# Altium schematic sheet Sheet1.SchDoc
size A4; SheetNumber: 1; SheetTotal: 1
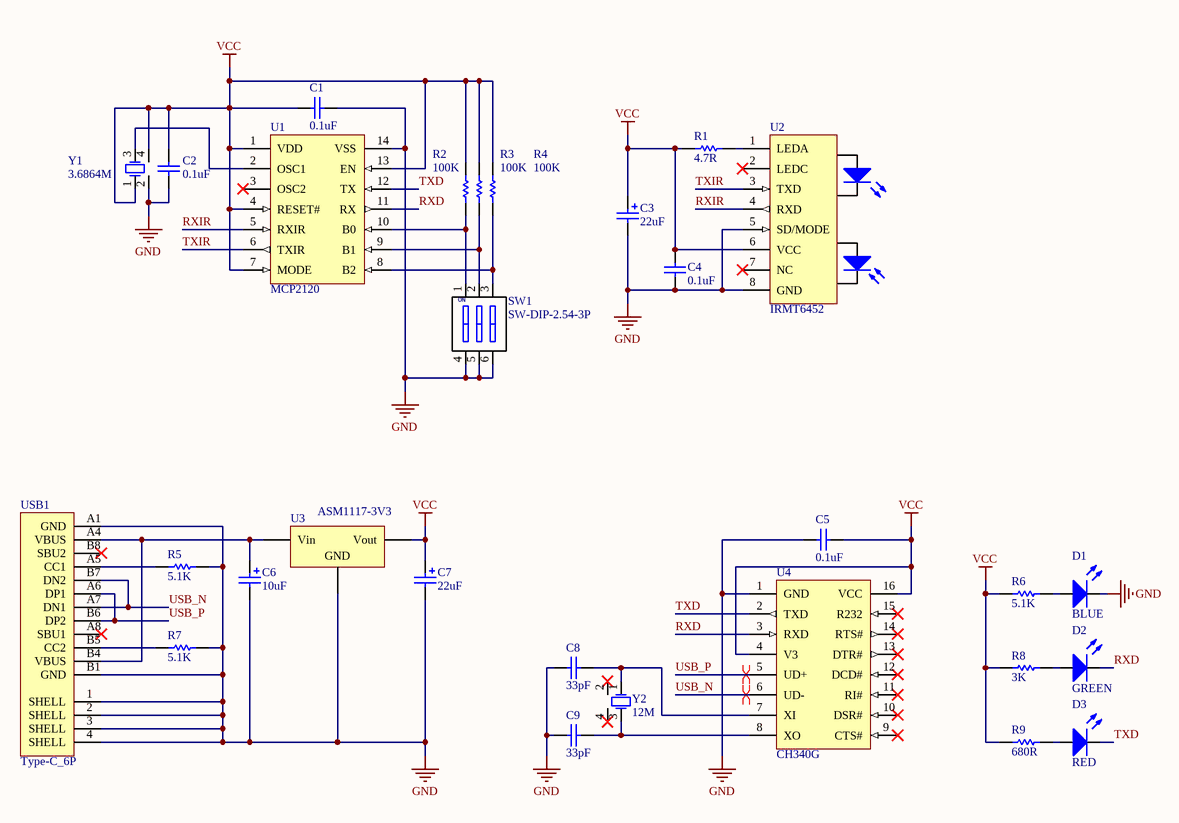
[diagram p0: Sheet1.SchDoc]

## Parts
C1  0.1uF  [0603-CAP]
C2  0.1uF  [0603-CAP]
C3  22uF  [3216-TCAP_M]
C4  0.1uF  [0603-CAP]
C5  0.1uF  [0603-CAP]
C6  10uF  [3216-TCAP_M]
C7  22uF  [3216-TCAP_M]
C8  33pF  [0603-CAP]
C9  33pF  [0603-CAP]
D1  BLUE  [0603-LED]
D2  GREEN  [0603-LED]
D3  RED  [0603-LED]
R1  4.7R  [0603-RES]
R2  100K  [0603-RES]
R3  100K  [0603-RES]
R4  100K  [0603-RES]
R5  5.1K  [0603-RES]
R6  5.1K  [0603-RES]
R7  5.1K  [0603-RES]
R8  3K  [0603-RES]
R9  680R  [0603-RES]
SW1  SW-DIP-2.54-3P  [SWITCH-DIP-2.54-3P]
U1  MCP2120  [SOP-14_M]
U2  IRMT6452  [IRMT6452_M]
U3  ASM1117-3V3  [SOT-89-3_M]
U4  CH340G  [SOP-16_M]
USB1  Type-C_6P  [TYPE-C_16P]
Y1  3.6864M  [CRYSTAL_3225SMD_M]
Y2  12M  [CRYSTAL_3225SMD_M]

## Nets
GND: C1.2 C2.1 C3.2 C4.1 C5.1 C6.2 C7.2 C8.1 C9.2 D1.1(K) R5.1 R7.1 SW1.4(B4) SW1.5(B5) SW1.6(B6) U1.14(VSS) U2.5(SD/MODE) U2.8(GND) U3.1(GND) U4.1(GND) USB1.1(SHELL) USB1.2(SHELL) USB1.3(SHELL) USB1.4(SHELL) USB1.A1(GND) USB1.B1(GND) Y1.2(GND)
VCC: C1.1 C2.2 C3.1 C4.2 C5.2 C7.1 R1.1 R2.2 R3.2 R4.2 R6.1 R8.1 R9.1 U1.1(VDD) U1.4(RESET#) U1.7(MODE) U1.13(EN) U2.6(VCC) U3.2(Vout) U4.4(V3) U4.16(VCC) Y1.1(OSC1) Y1.4(GND)
RXD: D2.1(K) U1.11(RX) U4.3(RXD)
RXIR: U1.5(RXIR) U2.4(RXD)
TXD: D3.1(K) U1.12(TX) U4.2(TXD)
TXIR: U1.6(TXIR) U2.3(TXD)
USB_N: U4.6(UD-) USB1.A7(DN1) USB1.B7(DN2)
USB_P: U4.5(UD+) USB1.A6(DP1) USB1.B6(DP2)
NetC6_1: C6.1 U3.3(Vin) USB1.A4(VBUS) USB1.B4(VBUS)
NetC8_2: C8.2 U4.7(XI) Y2.1(OSC1)
NetC9_1: C9.1 U4.8(XO) Y2.3(OSC2)
NetD1_2: D1.2(A) R6.2
NetD2_2: D2.2(A) R8.2
NetD3_2: D3.2(A) R9.2
NetR1_2: R1.2 U2.1(LEDA)
NetR2_1: R2.1 SW1.1(A1) U1.10(B0)
NetR3_1: R3.1 SW1.2(A2) U1.9(B1)
NetR4_1: R4.1 SW1.3(A3) U1.8(B2)
NetR5_2: R5.2 USB1.A5(CC1)
NetR7_2: R7.2 USB1.B5(CC2)
NetU1_2: U1.2(OSC1) Y1.3(OSC2)

Not connected (* = marked no-connect by the designer): U1 3(OSC2)*; U2 2(LEDC)* 7(NC)*; U4 9(CTS#)* 10(DSR#)* 11(RI#)* 12(DCD#)* 13(DTR#)* 14(RTS#)* 15(R232)*; USB1 A8(SBU1)* B8(SBU2)*; Y2 2(GND)* 4(GND)*

## Layout directives
differential pair: USB_N, USB_P

## Notes on the sheet
- (in symbol SW-DIP-2.54-3P) ON

## Library data of the parts
C1 C2 C4 C5 C8 C9 = CAP-0603
C3 C6 C7 = CAP-T-3216
D1-D3 = LED-0603
R1-R9 = RES-0603
U1 = MCP2120: Infrared Encoder/Decoder
U2 = IRMT6452: 4 Mb/s Infrared Data Transceiver
U3 = VREG-SOT-89: Voltage Regular (SOT-89)
U4 = CH340G: USB转串口芯片
Y1 = XTAL-3225SMD: oscillator
Y2 = XTAL-3225SMD: crystal